# EAGLE design espbreakout12e-1206 (EAGLE 7.6.0)
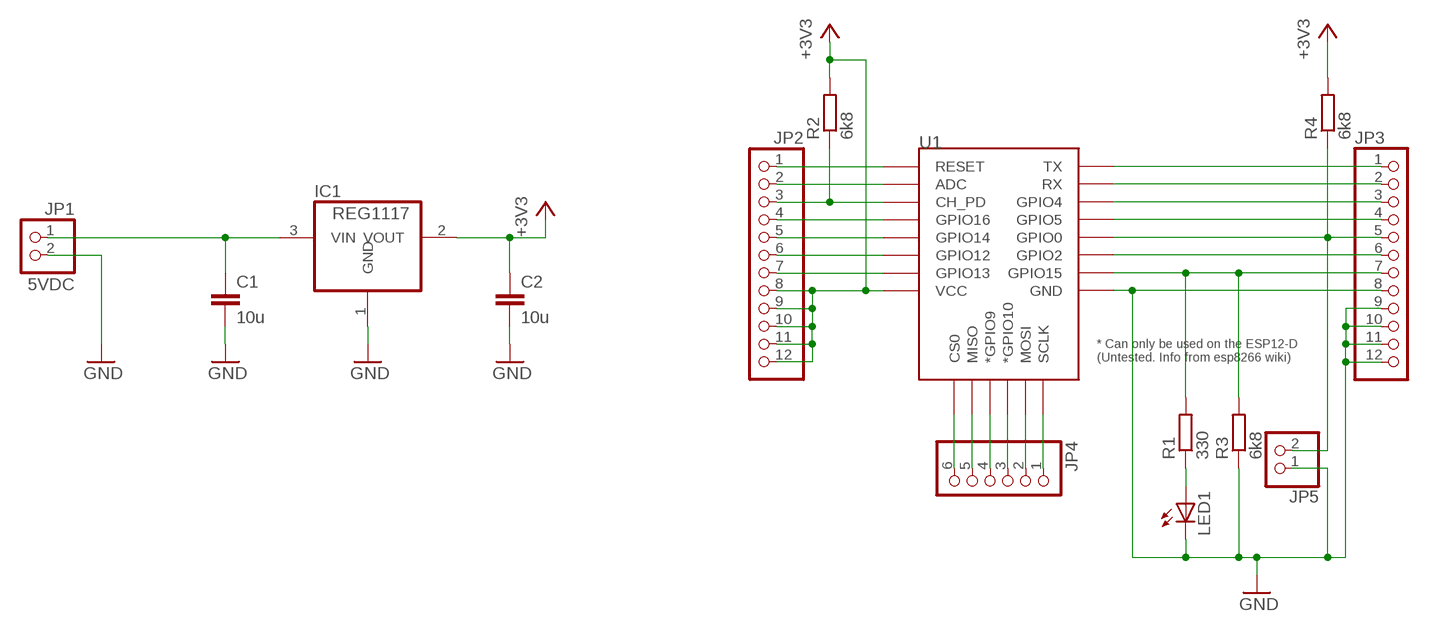
[diagram p0: schematic, sheet 1]

## Parts
C1  10u  C-EUC1206K  [C1206K]
C2  10u  C-EUC1206K  [C1206K]
IC1  REG1117  [SOT223]
JP1  5VDC  PINHD-1X2  [1X02]
JP2  PINHD-1X12  [1X12]
JP3  PINHD-1X12  [1X12]
JP4  PINHD-1X6  [1X06]
JP5  PINHD-1X2  [1X02]
LED1  LEDSML1206  [SML1206]
R1  330  R-EU_R1206  [R1206]
R2  6k8  R-EU_R1206  [R1206]
R3  6k8  R-EU_R1206  [R1206]
R4  6k8  R-EU_R1206  [R1206]
U1  ESP12ESMD  [ESP12E-SMD]

## Nets
+3V3: C2.1 IC1.2(VOUT) JP2.8 JP2.9 JP2.10 JP2.11 JP2.12 R2.2 R4.2 U1.VCC
GND: C1.2 C2.2 IC1.1(GND) JP1.2 JP3.8 JP3.9 JP3.10 JP3.11 JP3.12 JP5.1 LED1.C R3.1 U1.GND
N$1: C1.1 IC1.3(VIN) JP1.1
N$2: LED1.A R1.1
N$3: JP2.1 U1.RESET
N$4: JP2.2 U1.ADC
N$5: JP2.3 R2.1 U1.CH_PD
N$6: JP2.4 U1.GPIO16
N$7: JP2.5 U1.GPIO14
N$8: JP2.6 U1.GPIO12
N$9: JP2.7 U1.GPIO13
N$11: JP3.1 U1.TXD0(TX)
N$12: JP3.2 U1.RXD0(RX)
N$13: JP3.3 U1.GPIO4
N$14: JP3.4 U1.GPIO5
N$15: JP3.5 JP5.2 R4.1 U1.GPIO0
N$16: JP3.6 U1.GPIO2
N$17: JP3.7 R1.2 R3.2 U1.GPIO15
N$19: JP4.1 U1.SCLK
N$20: JP4.2 U1.MOSI
N$21: JP4.3 U1.GPIO10(*GPIO10)
N$22: JP4.4 U1.GPIO9(*GPIO9)
N$23: JP4.5 U1.MISO
N$24: JP4.6 U1.CS0

## Library data of the parts
C1 C2 = rcl:C-EU: CAPACITOR, European symbol
IC1 = burr-brown:REG1117: 800mA and 1A Low Dropout (LDO) Positive Regulator 1.8V, 2.5V, 2.85V, 3.3V, 5V, and Adj; MPN: REG1117; OC_FARNELL: 1097566; OC_NEWARK: 14P6981
JP1 JP5 = pinhead:PINHD-1X2: PIN HEADER
JP2 JP3 = pinhead:PINHD-1X12: PIN HEADER
JP4 = pinhead:PINHD-1X6: PIN HEADER
LED1 = led:LED: LED OSRAM: - CHIPLED LG R971, LG N971, LY N971, LG Q971, LY Q971, LO R971, LY R971 LH N974, LH R974 LS Q976, LO Q976, LY Q976 LO Q996 - Hyper CHIPLED LW Q18S LB Q993, LB Q99A, LB R99A - SideLED LS A670, LO A670, LY A670, LG A670, LP A670 LB A673, LV A673, LT A673, LW A673 LH A674 LY A675 LS A676, LA A676, LO A676, LY A676, LW A676 LS A679, LY A679, LG A679 - Hyper Micro SIDELED® LS Y876, LA Y876, LO Y876, LY Y876 LT Y87S - SmartLED LW L88C, LW L88S LB L89C, LB L89S, LG L890 LS L89K, LO L89K, LY L89K LS L896, LA L896, LO L896, LY L896 - TOPLED LS T670, LO T670, LY T670, LG T670, LP T670 LSG T670, LSP T670, LSY T670, LOP T670, LYG T670 LG T671, LOG T671, LSG T671 LB T673, LV T673, LT T673, LW T673 LH T674 LS T676, LA T676, LO T676, LY T676, LB T676, LH T676, LSB T676, LW T676 LB T67C, LV T67C, LT T67C, LS T67K, LO T67K, LY T67K, LW E67C LS E67B, LA E67B, LO E67B, LY E67B, LB E67C, LV E67C, LT E67C LW T67C LS T679, LY T679, LG T679 LS T770, LO T770, LY T770, LG T770, LP T770 LB T773, LV T773, LT T773, LW T773 LH T774 LS E675, LA E675, LY E675, LS T675 LS T776, LA T776, LO T776, LY T776, LB T776 LHGB T686 LT T68C, LB T68C - Hyper Mini TOPLED® LB M676 - Mini TOPLED Santana® LG M470 LS M47K, LO M47K, LY M47K Source: http://www.osram.convergy.de LUXEON: - LUMILED® LXK2-PW12-R00, LXK2-PW12-S00, LXK2-PW14-U00, LXK2-PW14-V00 LXK2-PM12-R00, LXK2-PM12-S00, LXK2-PM14-U00 LXK2-PE12-Q00, LXK2-PE12-R00, LXK2-PE12-S00, LXK2-PE14-T00, LXK2-PE14-U00 LXK2-PB12-K00, LXK2-PB12-L00, LXK2-PB12-M00, LXK2-PB14-N00, LXK2-PB14-P00, LXK2-PB14-Q00 LXK2-PR12-L00, LXK2-PR12-M00, LXK2-PR14-Q00, LXK2-PR14-R00 LXK2-PD12-Q00, LXK2-PD12-R00, LXK2-PD12-S00 LXK2-PH12-R00, LXK2-PH12-S00 LXK2-PL12-P00, LXK2-PL12-Q00, LXK2-PL12-R00 Source: www.luxeon.com KINGBRIGHT: KA-3528ASYC Source: www.kingbright.com
R1-R4 = resistor:R-EU_: RESISTOR, European symbol
U1 = esp8266modules:ESP12E: ESP12E Module

## Board
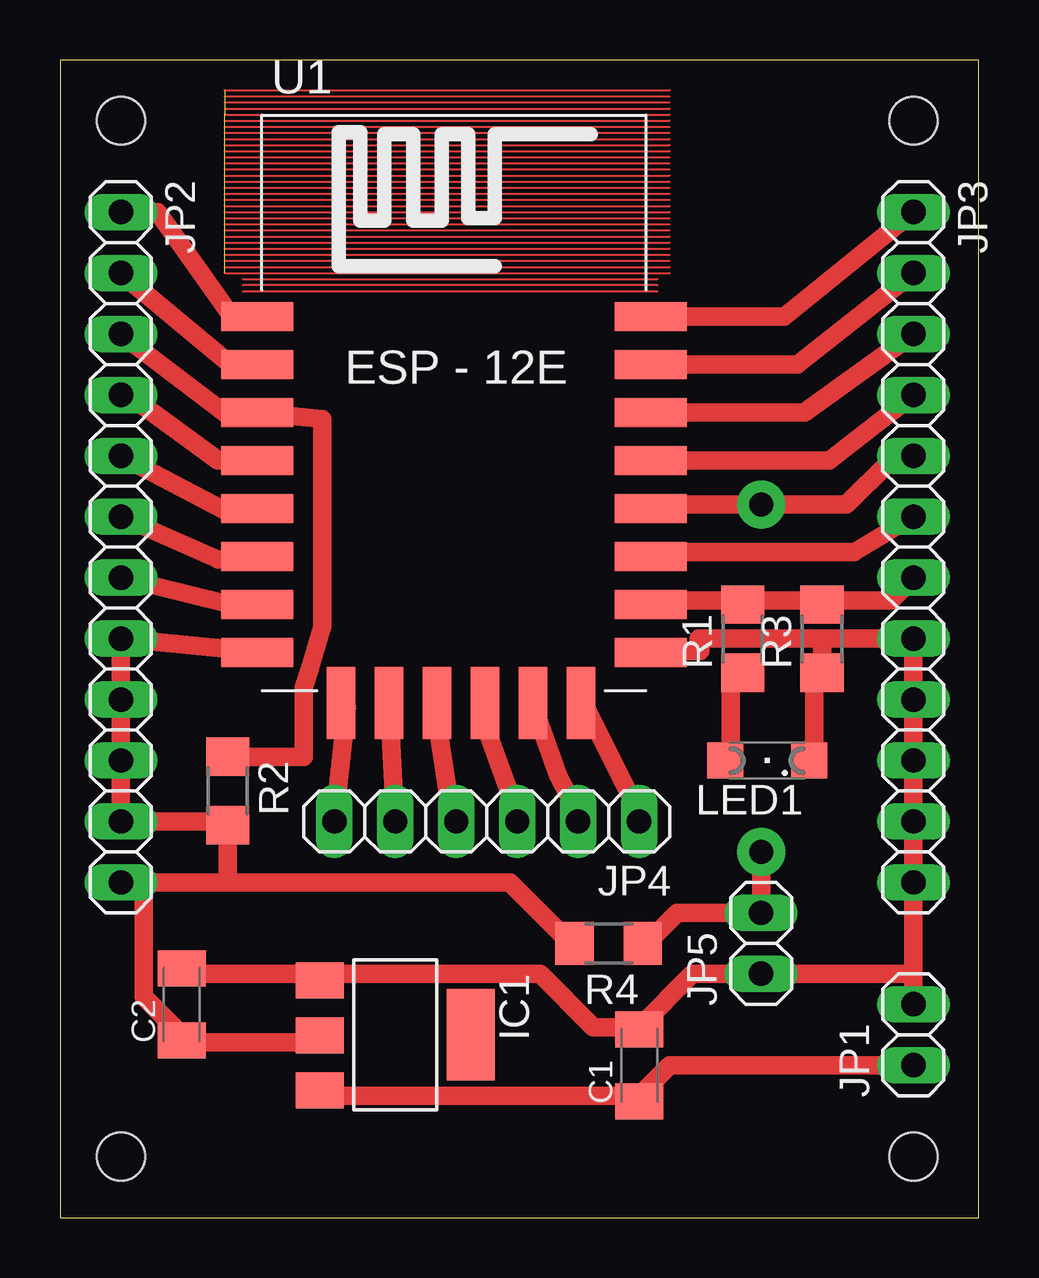
[diagram p1: board, top side]
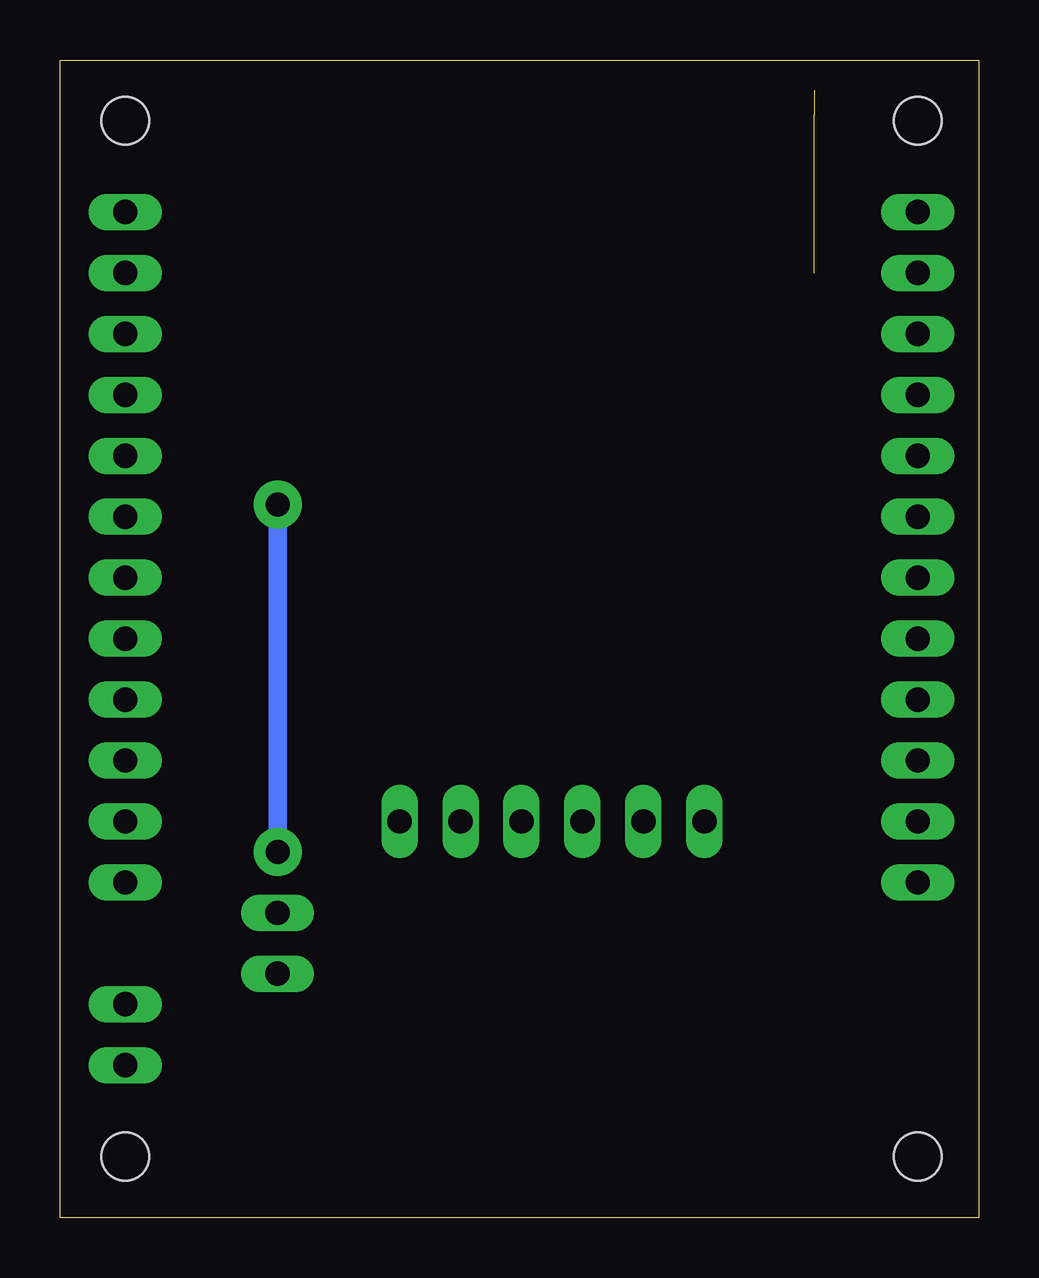
[diagram p2: board, bottom side, seen from below]

Size 38.28 x 48.25 mm. Coordinates in mm from the lower left corner, seen from the top.
Outline: 0,0 38.28,0 38.28,48.25 0,48.25 0,0
Copper layers (1*16): Top 0.035mm / dielectric 1.5mm / Bottom 0.035mm
Design rules "default *": minimum track width 30mil, minimum drill 24mil, track to track 8mil, track to pad 8mil, pad to pad 8mil, via to via 8mil, smd to smd 8mil, copper to edge 40mil, drill to drill 8mil, minimum pad ring 10mil, minimum via ring 8mil, stop-mask expansion 4mil, vias tented up to drill 0mil, thermal gap 10mil
Holes 2 mm at 2.54,2.54 35.56,2.54 35.56,45.72 2.54,45.72

### Footprints (pad centres in the part's own frame; a part is rotated, then mirrored left to right if it is on the bottom)
C1206K = smd 1.5 x 2: 1 -1.5,0; 2 1.5,0
SOT223 = smd 1.499 x 2.007: 1 -2.261,-3.15; 2 0.025,-3.15; 3 2.311,-3.15 | smd 3.81 x 2.007: 4 0,3.15
1X02 = drill 1.016 long: 1 -1.27,0; 2 1.27,0
1X12 = drill 1.016 long: 1 -13.97,0; 2 -11.43,0; 3 -8.89,0; 4 -6.35,0; 5 -3.81,0; 6 -1.27,0; 7 1.27,0; 8 3.81,0; 9 6.35,0; 10 8.89,0; 11 11.43,0; 12 13.97,0
1X06 = drill 1.016 long: 1 -6.35,0; 2 -3.81,0; 3 -1.27,0; 4 1.27,0; 5 3.81,0; 6 6.35,0
SML1206 = smd 1.5 x 1.5: A 1.75,0; C -1.75,0
R1206 = smd 1.6 x 1.803: 1 -1.422,0; 2 1.422,0
ESP12E-SMD = smd 3 x 1.2: ADC -8.3,3.8; CH_PD -8.3,1.8; GND 8.1,-8.2; GPIO0 8.1,-2.2; GPIO2 8.1,-4.2; GPIO4 8.1,1.8; GPIO5 8.1,-0.2; GPIO12 -8.3,-4.2; GPIO13 -8.3,-6.2; GPIO14 -8.3,-2.2; GPIO15 8.1,-6.2; GPIO16 -8.3,-0.2; RESET -8.3,5.8; RXD0 8.1,3.8; TXD0 8.1,5.8; VCC -8.3,-8.2 | smd 1.2 x 3: CS0 -4.8,-10.3; GPIO9 -0.8,-10.3; GPIO10 1.2,-10.3; MISO -2.8,-10.3; MOSI 3.2,-10.3; SCLK 5.2,-10.3

### Placement (x,y rotation side)
C1  24.13,6.35 90 top
C2  5.08,8.89 90 top
IC1  13.97,7.62 270 top
JP1  35.56,7.62 90 top
JP2  2.54,27.94 270 top
JP3  35.56,27.94 270 top
JP4  17.78,16.51 180 top
JP5  29.21,11.43 90 top
LED1  29.46,19.05 180 top
R1  28.45,24.13 90 top
R2  6.99,17.78 270 top
R3  31.75,24.13 90 top
R4  22.86,11.43 180 top
U1  16.51,31.75 0 top

### Tracks (layer width: path | path; a pad name or v marks a point on that pad's centre or on a via)
+3V3
  Top 0.762: U1.VCC 7.43,23.56 7.87,23.62 JP2.8 JP2.9 JP2.10 JP2.11 6.99,16.51 R2.2 6.99,13.97 | IC1.2 10.79,7.3 5.08,7.3 C2.1 5.08,7.62 3.49,9.21 3.49,13.65 JP2.12 6.99,13.97 | 6.99,13.97 18.73,13.97 21.27,11.43 R4.2
GND
  Top 0.762: C2.2 5.08,10.16 10.79,10.16 IC1.1 11.11,10.16 20,10.16 22.23,7.94 23.81,7.94 C1.2 24.13,7.94 26.35,10.16 JP5.1 35.56,10.16 | 35.56,10.16 JP3.12 JP3.11 JP3.10 JP3.9 JP3.8 31.75,24.13 | 35.56,10.16 JP1.2 | LED1.C 31.43,19.05 31.43,22.54 31.75,22.54 R3.1 31.75,24.13 | 31.75,24.13 26.61,24.13 26.67,23.62 24.96,23.62 24.26,23.56 U1.GND
N$1
  Top 0.762: JP1.1 25.4,6.35 24.13,5.08 C1.1 23.81,5.08 11.11,5.08 IC1.3
N$2
  Top 0.762: LED1.A 27.94,19.05 27.94,22.54 28.26,22.54 R1.1
N$3
  Top 0.762: JP2.1 4.06,41.91 7.18,37.53 U1.RESET
N$4
  Top 0.762: JP2.2 7.11,35.56 U1.ADC
N$5
  Top 0.762: JP2.3 6.86,33.53 U1.CH_PD 10.92,33.27 10.92,24.64 10.41,22.86 10.16,22.1 10.16,19.2 R2.1
N$6
  Top 0.762: JP2.4 2.86,34.29 6.6,31.56 8.64,31.56 7.94,31.75 U1.GPIO16
N$7
  Top 0.762: JP2.5 6.86,29.46 U1.GPIO14
N$8
  Top 0.762: JP2.6 6.6,27.43 U1.GPIO12
N$9
  Top 0.762: JP2.7 6.92,25.59 9.34,25.59 7.94,25.72 U1.GPIO13
N$10  (30 unrouted)
  Top 0.076: 6.86,45.97 25.4,45.97 | 6.86,45.72 25.4,45.72 | 6.86,45.47 25.4,45.47 | 6.86,45.21 25.4,45.21 | 6.86,44.96 25.4,44.96 | 6.86,44.7 25.4,44.7 | 6.86,44.45 25.4,44.45 | 6.86,44.2 25.4,44.2 | 6.86,43.94 25.4,43.94 | 6.86,43.69 25.4,43.69 | 6.86,43.43 25.4,43.43 | 6.86,43.18 25.4,43.18 | 6.86,42.93 25.4,42.93 | 6.86,42.67 25.4,42.67 | 6.86,42.42 25.4,42.42 | 6.86,42.16 25.4,42.16 | 6.86,41.91 25.4,41.91 | 6.86,41.66 25.4,41.66 | 6.86,41.4 25.4,41.4 | 6.86,41.15 25.4,41.15 | 6.86,40.89 25.4,40.89 | 6.86,40.64 25.4,40.64 | 6.86,40.39 25.4,40.39 | 6.86,39.88 25.4,39.88 | 6.86,39.62 25.4,39.62 | 6.86,39.37 25.4,39.37 | 6.86,46.23 25.4,46.23 | 6.86,46.48 25.4,46.48 | 6.86,46.74 25.4,46.74 | 6.86,46.99 25.4,46.99 | 6.86,40.13 25.4,40.13 6.86,40.13
N$11
  Top 0.762: U1.TXD0 30.18,37.55 JP3.1
N$12
  Top 0.762: U1.RXD0 30.72,35.55 JP3.2
N$13
  Top 0.762: U1.GPIO4 31.01,33.55 JP3.3
N$14
  Top 0.762: U1.GPIO5 32.06,31.55 JP3.4
N$15  (via drill 1 pad 2)
  Top 0.762: R4.1 24.45,11.43 25.72,12.7 JP5.2 v29.21,15.24 | U1.GPIO0 26.05,29.72 v29.21,29.72 32.77,29.72 34.54,31.5 35.31,31.5 JP3.5
  Bottom 0.762: v29.21,15.24 v29.21,29.72
N$16
  Top 0.762: JP3.6 33.08,27.75 23.88,27.75 24.77,27.62 U1.GPIO2
N$17
  Top 0.762: U1.GPIO15 24.77,25.72 28.26,25.72 R1.2 28.57,25.72 31.75,25.72 R3.2 32.07,25.72 34.61,25.72 JP3.7
N$18
  Top 0.076: 7.62,39.12 24.89,39.12
N$19
  Top 0.762: JP4.1 24.19,16.76 23.43,18.22 21.91,21.27 U1.SCLK
N$20
  Top 0.762: JP4.2 21.59,16.83 20.77,18.41 19.75,21.27 U1.MOSI
N$21
  Top 0.762: JP4.3 19.05,16.83 17.53,21.02 U1.GPIO10
N$22
  Top 0.762: JP4.4 16.38,16.26 15.62,21.27 U1.GPIO9
N$23
  Top 0.762: JP4.5 13.72,21.27 U1.MISO
N$24
  Top 0.762: JP4.6 11.94,21.27 U1.CS0
N$25
  Top 0.076: 24.89,38.86 7.62,38.86
N$26
  Top 0.076: 7.62,38.61 24.89,38.61